# EasyEDA Pro project STM_Basic_Extender.epro

# Schematic Schematic1
Company: 嘉立创EDA; Page Size: A4; Version: V1.0
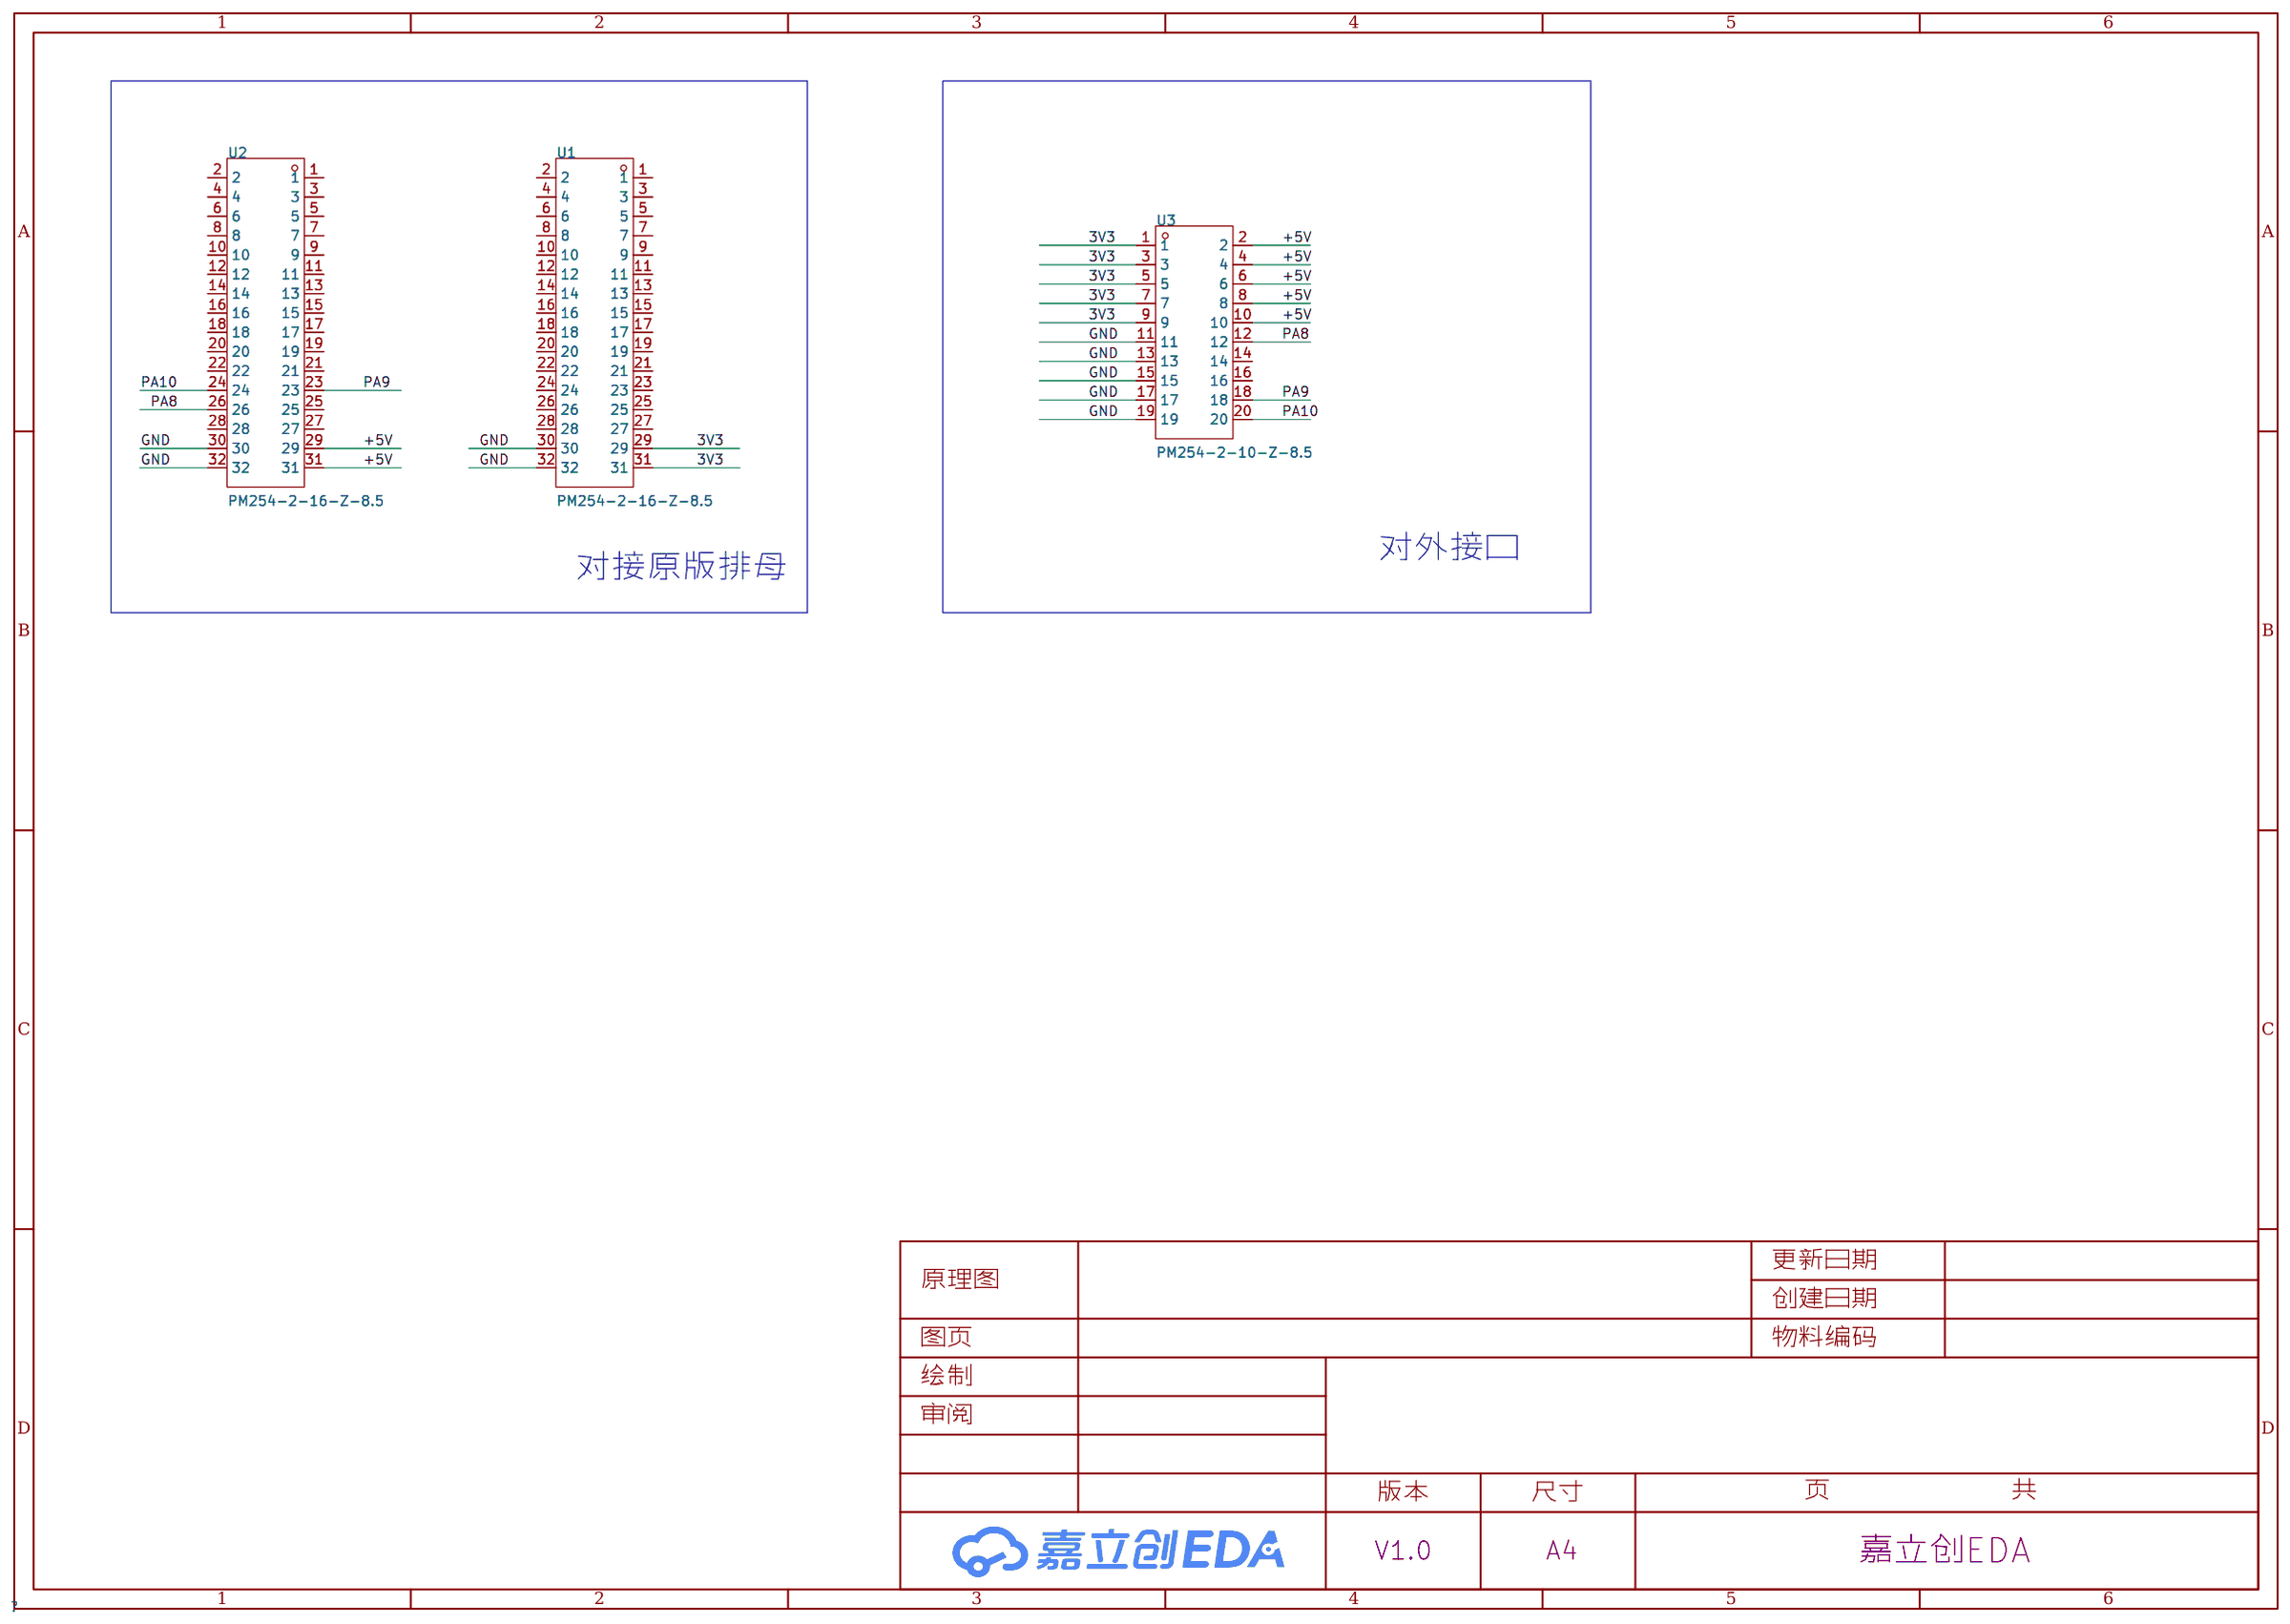
[diagram p0: schematic sheet]

## Parts
U1  PM254-2-16-Z-8.5  [HDR-TH_32P-P2.54-V-F-R2-C16-S2.54]
U2  PM254-2-16-Z-8.5  [HDR-TH_32P-P2.54-V-F-R2-C16-S2.54]
U3  PM254-2-10-Z-8.5  [HDR-TH_20P-P2.54-V-F-R2-C10-S2.54]

## Library data of the parts
U1 U2 = PM254-2-16-Z-8.5: 插孔结构:2x16P;间距:2.54mm;行距:2.54mm;圆孔/方孔:方孔;安装类型:直插;排数:双排;总孔位数:32P;额定电流:3A;额定电压:-;插孔方向:顶部;塑高:8.5mm;触头材质:铜合金;工作温度范围:-40℃~+105℃;焊接温度(最大值):260℃@5S;; LCSC Part Name: 2x16P 间距:2.54mm 直插; Supplier Part: C2897417; Manufacturer: HCTL(华灿天禄); Supplier Footprint: 插件,P=2.54mm; JLCPCB Part Class: 扩展库; Datasheet: https://atta.szlcsc.com/upload/public/pdf/source/20230609/3D36CA2C1BFC9FD1C3F709AD9DFEB9C2.pdf; Supplier: LCSC; Holes Structure: 2x16P; Pitch: 2.54mm; Row Spacing: 2.54mm; Circular Hole / Square Hole: 方孔; Mounting Type: 直插; Number of Rows: 双排; Number of Holes: 32P; Current Rating (Max): 3A; Holes Direction: 顶部; Insulation Height: 8.5mm; Contact Material: 铜合金; Operating Temperature Range: -40℃~+105℃; Soldering Temperature(Max): 260℃@5S
U3 = PM254-2-10-Z-8.5: 插孔结构:2x10P;间距:2.54mm;行距:2.54mm;圆孔/方孔:方孔;安装类型:直插;排数:双排;总孔位数:20P;额定电流:3A;额定电压:-;插孔方向:顶部;塑高:8.5mm;触头材质:铜合金;工作温度范围:-40℃~+105℃;焊接温度(最大值):260℃@5S;; LCSC Part Name: 2x10P 间距:2.54mm 直插; Supplier Part: C2897411; Manufacturer: HCTL(华灿天禄); Supplier Footprint: 插件,P=2.54mm; JLCPCB Part Class: 扩展库; Datasheet: https://atta.szlcsc.com/upload/public/pdf/source/20230609/3D36CA2C1BFC9FD1C3F709AD9DFEB9C2.pdf; Supplier: LCSC; Holes Structure: 2x10P; Pitch: 2.54mm; Row Spacing: 2.54mm; Circular Hole / Square Hole: 方孔; Mounting Type: 直插; Number of Rows: 双排; Number of Holes: 20P; Current Rating (Max): 3A; Holes Direction: 顶部; Insulation Height: 8.5mm; Contact Material: 铜合金; Operating Temperature Range: -40℃~+105℃; Soldering Temperature(Max): 260℃@5S

## Nets
3V3: U1.29 U1.31 U3.1 U3.3 U3.5 U3.7 U3.9
+5V: U2.29 U2.31 U3.2 U3.4 U3.6 U3.8 U3.10
GND: U1.30 U1.32 U2.30 U2.32 U3.11 U3.13 U3.15 U3.17 U3.19
PA8: U2.26 U3.12
PA9: U2.23 U3.18
PA10: U2.24 U3.20

Not connected (* = marked no-connect by the designer): U1 1 2 3 4 5 6 7 8 9 10 11 12 13 14 15 16 17 18 19 20 21 22 23 24 25 26 27 28; U2 1 2 3 4 5 6 7 8 9 10 11 12 13 14 15 16 17 18 19 20 21 22 25 27 28; U3 14 16

## Notes on the sheet
- 对外接口
- 对接原版排母

# Board PCB1
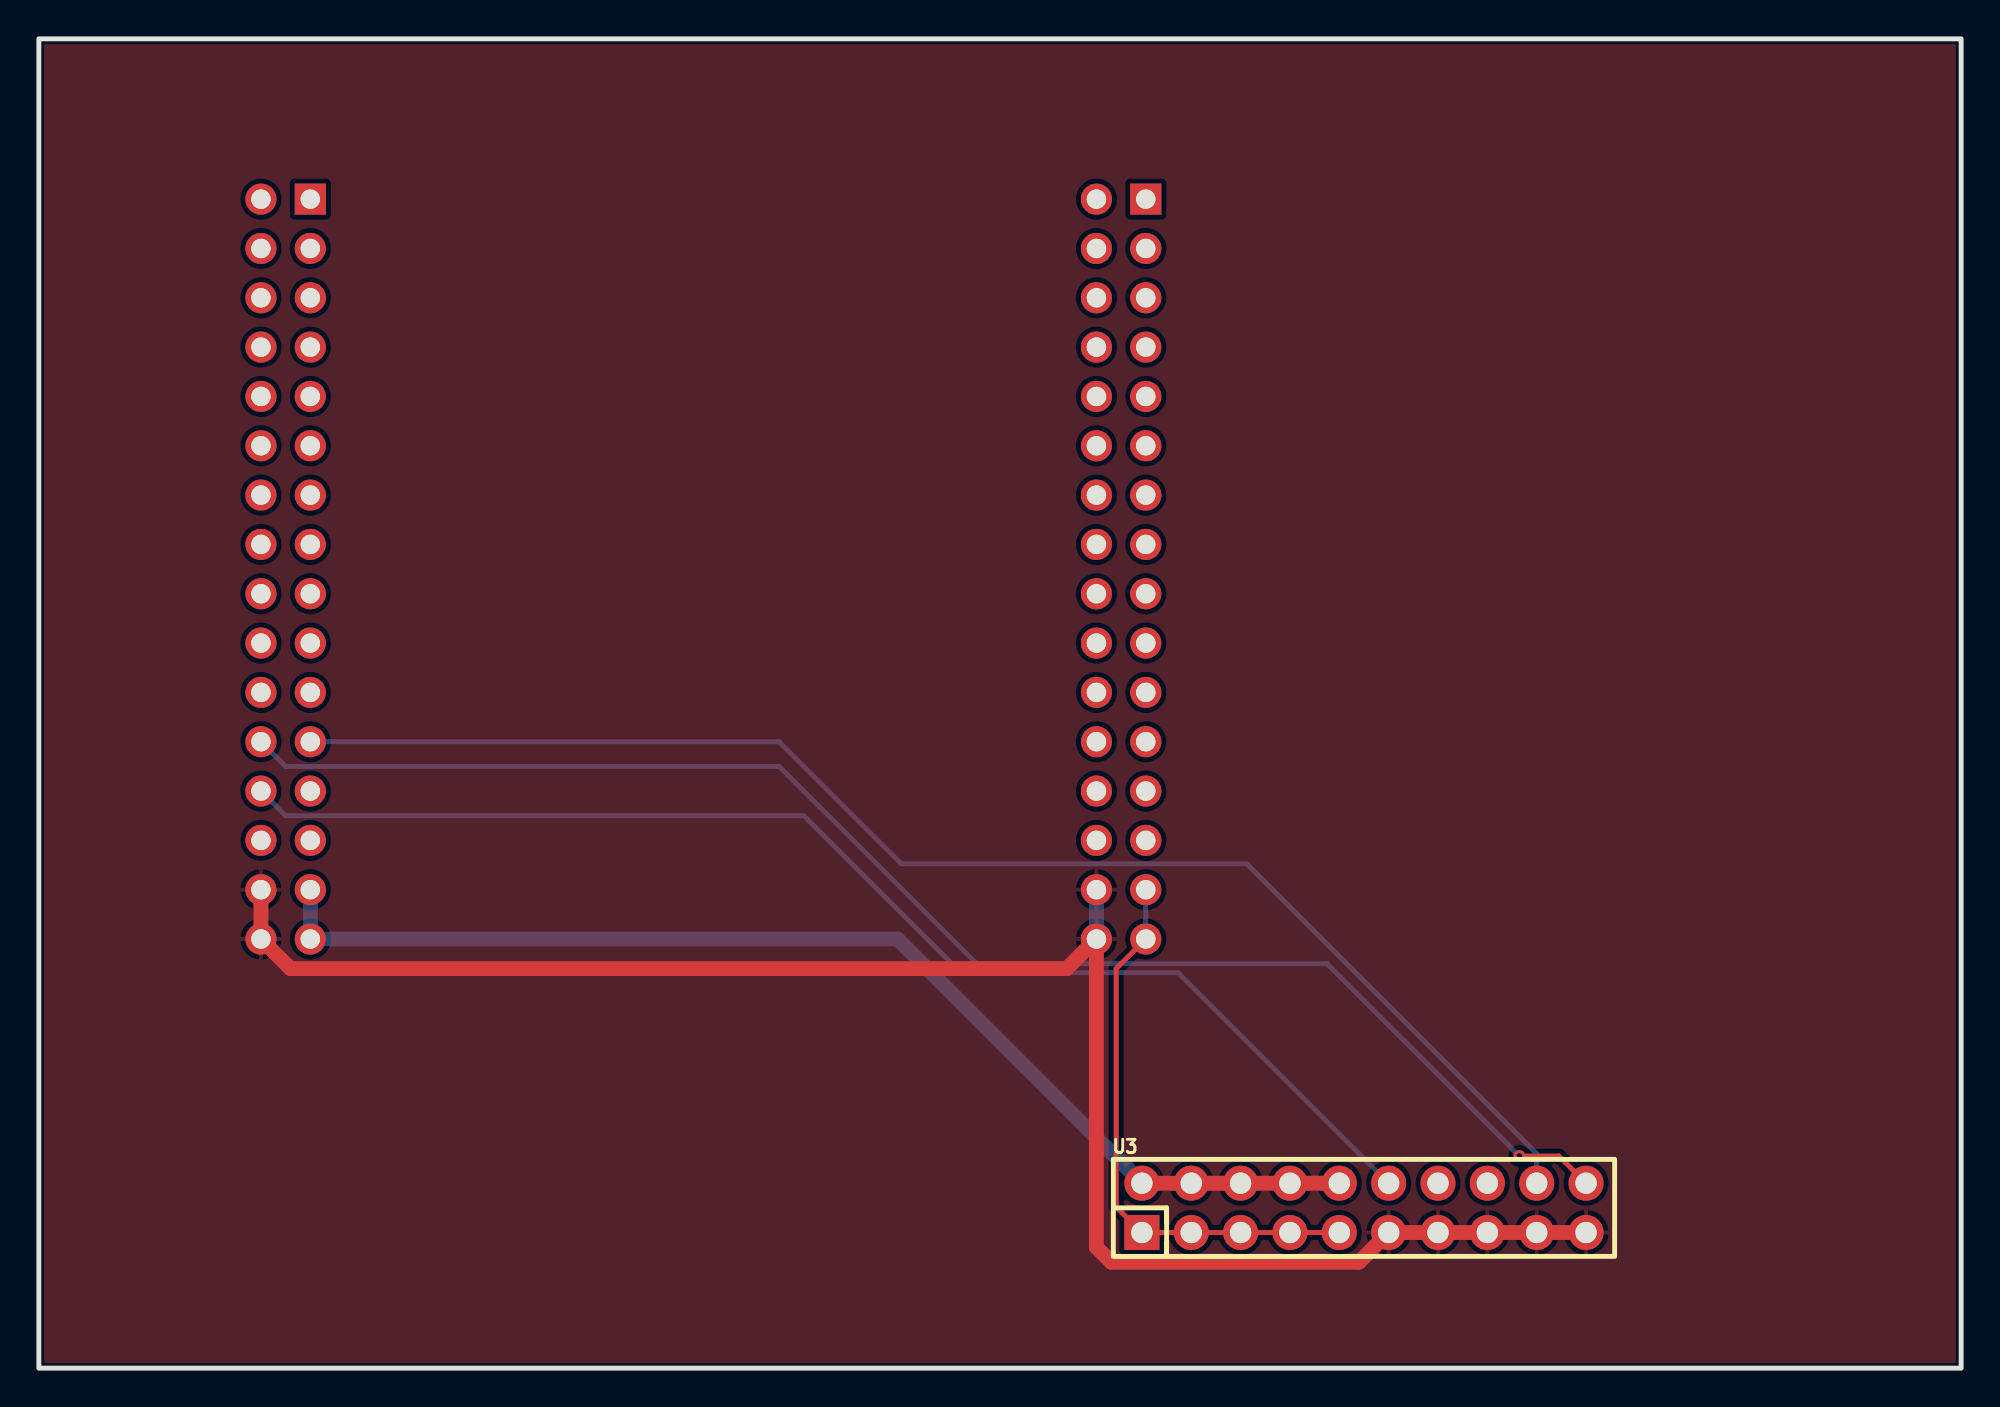
[diagram p1: board, top side]
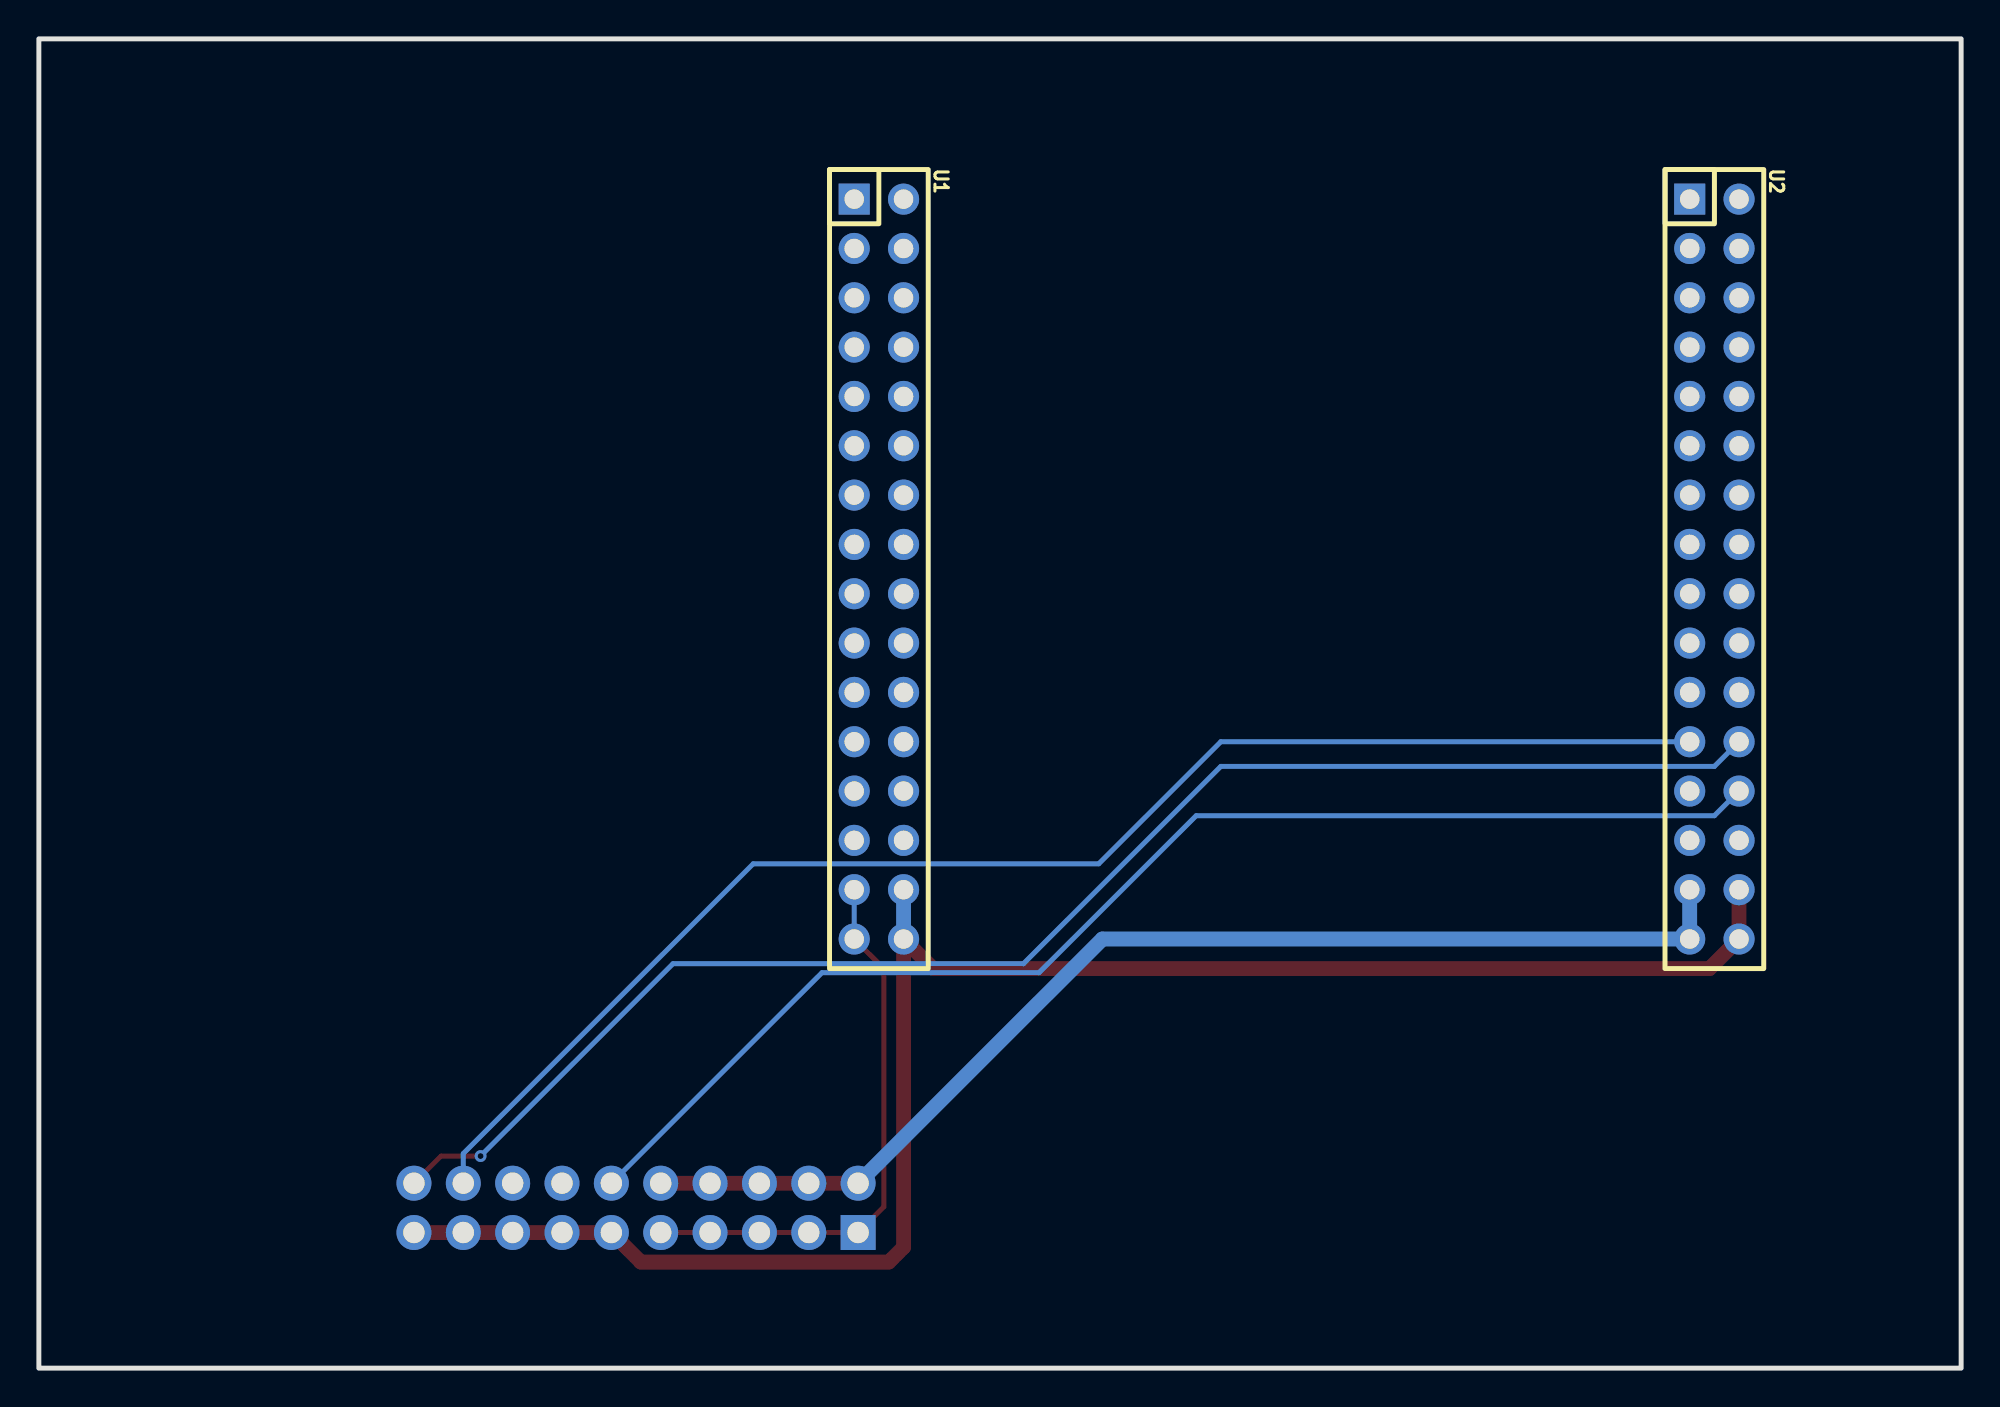
[diagram p2: board, bottom side, seen from below]

Outline 98.93 x 68.45 mm; copper layers: Top Layer, Bottom Layer. Coordinates in mm from the lower left corner of the outline.
Outline path: rectangle 0,68.45 98.93,0
Stack: Top Layer 0.035mm / Dielectric1 1.51mm FR4 er 4.5 / Bottom Layer 0.035mm

## Design rules (mm)
template: 自定义配置
spacing copperThickness1oz (default): track to track 0.102, other pairs 0.152 to 0.3
spacing copperThickness2oz: track to track 0.203, other pairs 0.152 to 0.3
track width copperThickness1oz (default): min 0.127, default 0.254, max 2.54
track width copperThickness2oz: min 0.203, default 0.254, max 2.54
track width Thick: min 0.762, default 0.762, max 2.54
differential pair differentialPair (default): width min 0.127, default 0.254, max 2.54; gap min 0.152, default 0.152
via viaSize (default): diameter min 0.5, default 0.61, max 10; hole min 0.3, default 0.305, max 6.299
net GND uses Thick, copperThickness2oz
net 3V3 uses copperThickness2oz
net +5V uses Thick, copperThickness2oz
net PA8 uses copperThickness2oz
net PA10 uses copperThickness2oz
net PA9 uses copperThickness2oz

## Placement (name value [footprint] x y rotation side)
U1  PM254-2-16-Z-8.5  [HDR-TH_32P-P2.54-V-F-R2-C16-S2.54]  55.7 41.15 270 bottom
U2  PM254-2-16-Z-8.5  [HDR-TH_32P-P2.54-V-F-R2-C16-S2.54]  12.7 41.15 270 bottom
U3  PM254-2-10-Z-8.5  [HDR-TH_20P-P2.54-V-F-R2-C10-S2.54]  68.2 8.26 0 top

## Footprints (pads in the part's own frame, mm; a bottom-side part is the same pattern mirrored in y, then rotated)
HDR-TH_20P-P2.54-V-F-R2-C10-S2.54
  rect 1.8x1.8 hole 1.1: 1(-11.43,-1.27)
  round 1.8 hole 1.1: 2(-11.43,1.27) 3(-8.89,-1.27) 4(-8.89,1.27) 5(-6.35,-1.27) 6(-6.35,1.27) 7(-3.81,-1.27) 8(-3.81,1.27) 9(-1.27,-1.27) 10(-1.27,1.27) 11(1.27,-1.27) 12(1.27,1.27) 13(3.81,-1.27) 14(3.81,1.27) 15(6.35,-1.27) 16(6.35,1.27) 17(8.89,-1.27) 18(8.89,1.27) 19(11.43,-1.27) 20(11.43,1.27)
HDR-TH_32P-P2.54-V-F-R2-C16-S2.54
  rect 1.6x1.6 hole 1: 1(-19.05,-1.27)
  round 1.6 hole 1: 2(-19.05,1.27) 3(-16.51,-1.27) 4(-16.51,1.27) 5(-13.97,-1.27) 6(-13.97,1.27) 7(-11.43,-1.27) 8(-11.43,1.27) 9(-8.89,-1.27) 10(-8.89,1.27) 11(-6.35,-1.27) 12(-6.35,1.27) 13(-3.81,-1.27) 14(-3.81,1.27) 15(-1.27,-1.27) 16(-1.27,1.27) 17(1.27,-1.27) 18(1.27,1.27) 19(3.81,-1.27) 20(3.81,1.27) 21(6.35,-1.27) 22(6.35,1.27) 23(8.89,-1.27) 24(8.89,1.27) 25(11.43,-1.27) 26(11.43,1.27) 27(13.97,-1.27) 28(13.97,1.27) 29(16.51,-1.27) 30(16.51,1.27) 31(19.05,-1.27) 32(19.05,1.27)

## Nets
As in the schematic.

Pads without a net: U1 1 2 3 4 5 6 7 8 9 10 11 12 13 14 15 16 17 18 19 20 21 22 23 24 25 26 27 28; U2 1 2 3 4 5 6 7 8 9 10 11 12 13 14 15 16 17 18 19 20 21 22 25 27 28; U3 14 16

## Via types
v1: diameter 0.61, hole 0.305, Top Layer to Bottom Layer, 1 via

## Routing (per net, layer and track width the routed paths; a pad name or vN(x,y) marks a point on that pad's centre or on a via; arc(x,y) is an arc through that point)
3V3: length 29
  Top Layer w0.254: U1.31 55.45,20.57 55.45,8.31 U3.1 U3.5 U3.7 U3.9
  Bottom Layer w0.254: U1.31 U1.29
+5V: length 60.7
  Top Layer w0.762: 66.93,9.53 56.77,9.53
  Bottom Layer w0.762: U2.29 U2.31 44.2,22.1 56.77,9.53
GND: length 91.4
  Top Layer w0.762: U2.30 U2.32 12.95,20.57 52.91,20.57 U1.32 54.43,6.22 55.19,5.46 67.95,5.46 U3.11 U3.13 U3.15 U3.17 U3.19
  Bottom Layer w0.762: U1.32 U1.30
PA8: length 66.4
  Bottom Layer w0.254: 69.47,9.53 58.63,20.37 47.45,20.37 39.37,28.45 12.7,28.45 U2.26
PA9: length 73.4
  Bottom Layer w0.254: 77.09,9.53 77.09,11.05 62.17,25.97 44.39,25.97 38.1,32.26 U2.23
PA10: length 77.6
  Top Layer w0.254: 79.63,9.53 78.23,10.92 v1(76.2,10.92)
  Bottom Layer w0.254: U2.24 12.7,30.99 38.1,30.99 48.26,20.83 66.29,20.83 v1(76.2,10.92)

## Copper pours and planes (outline as drawn; the poured copper is in the pictures)
GND on Top Layer: -3.68,70.87 101.35,70.87 101.35,-1.78 -3.68,-1.78
